# EAGLE design STM32F030 v1 (EAGLE 6.5.0)
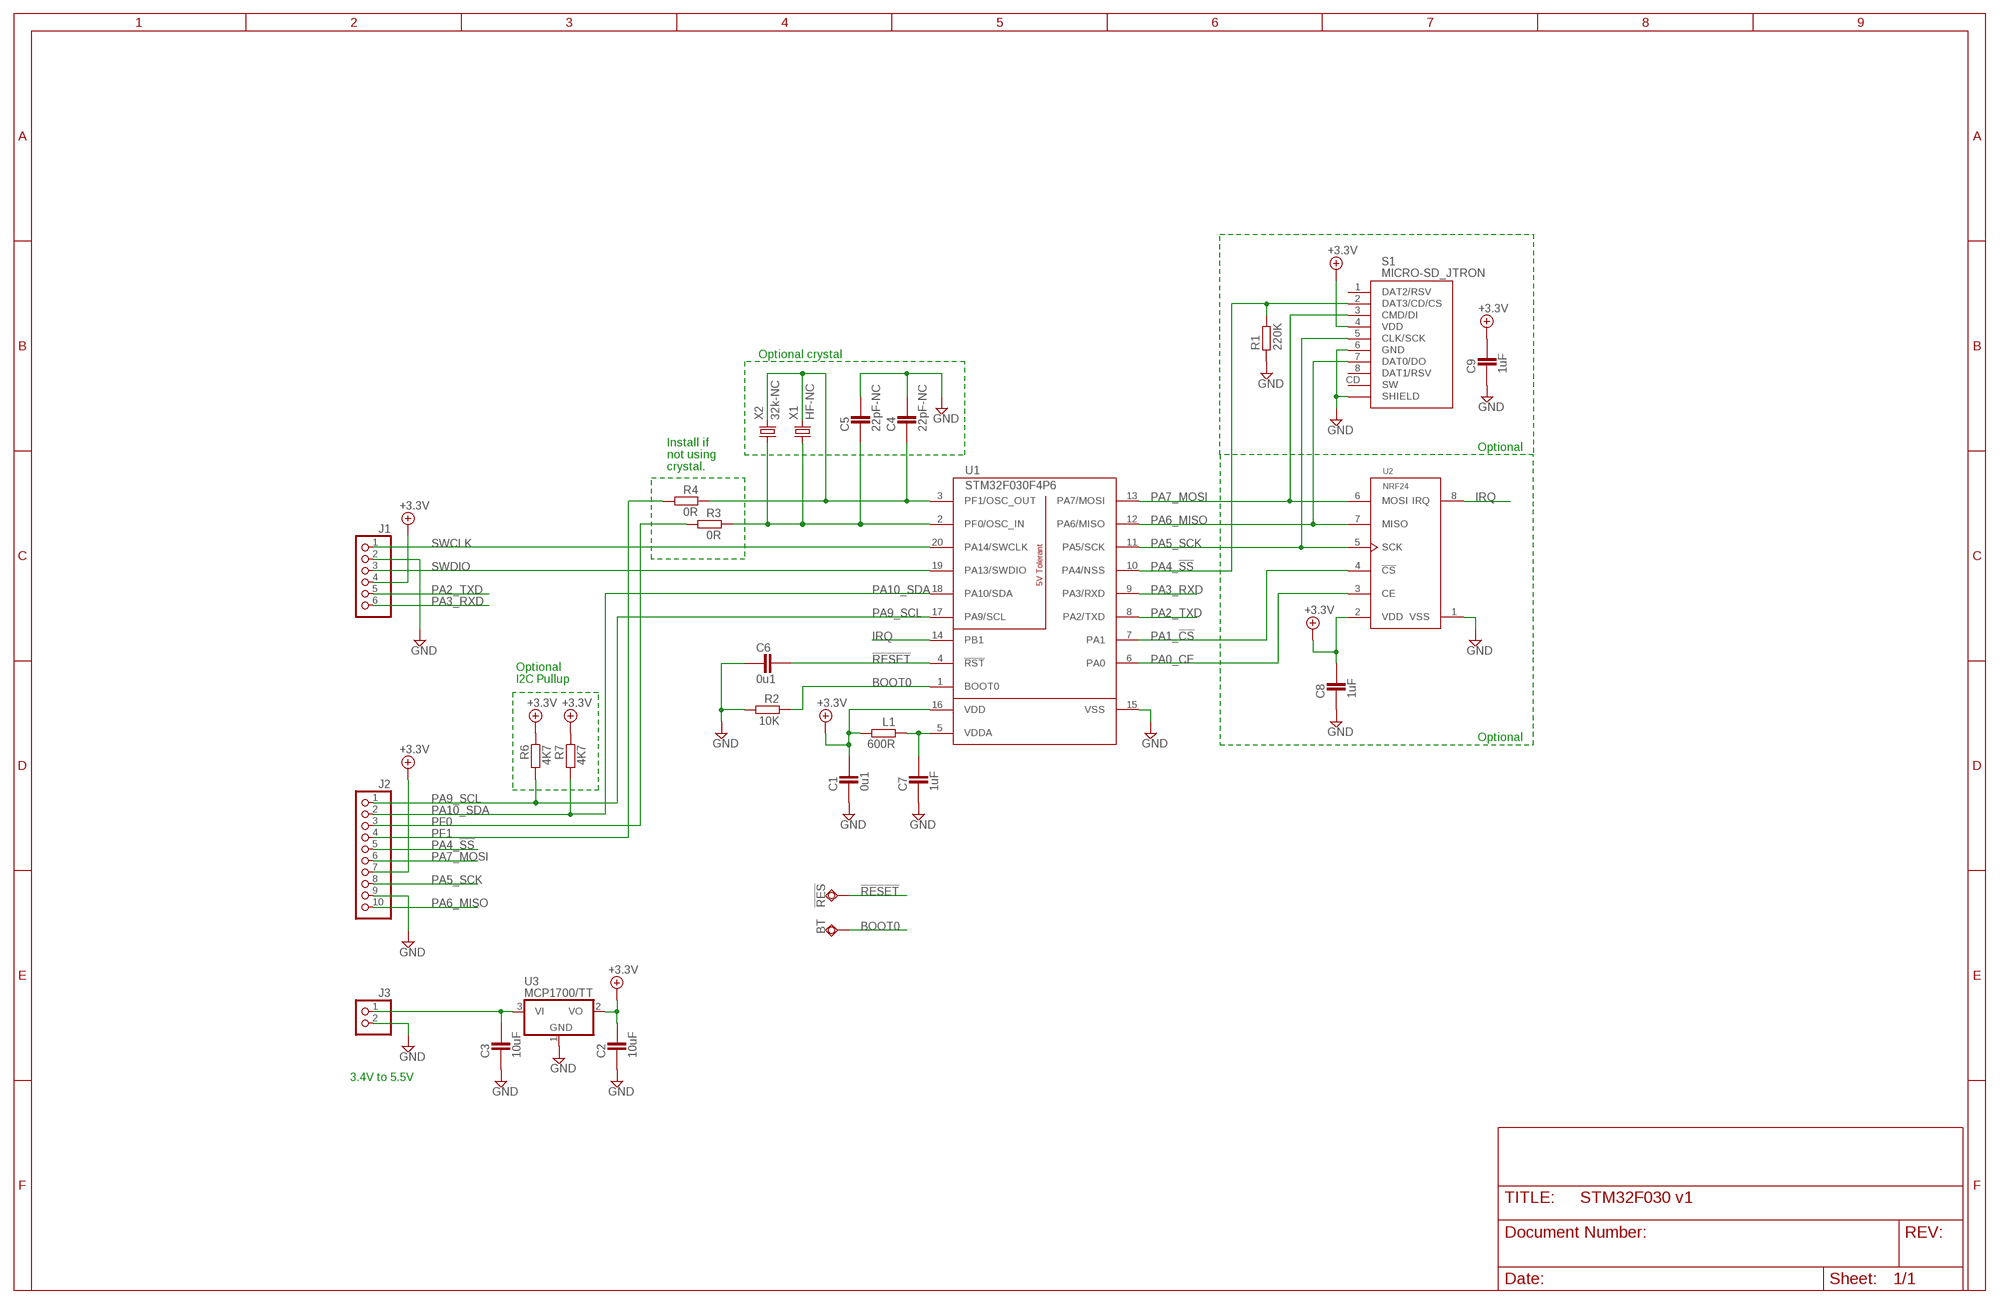
[diagram p0: schematic, sheet 1]

## Parts
!RES  TPSQTP08SQ  [TP08SQ]
BT  TPSQTP08SQ  [TP08SQ]
C1  0u1  CAPACITOR_0603  [CAPC1608X92N]
C2  10uF  CAPACITOR_0805  [CAPC2012X145AN]
C3  10uF  CAPACITOR_0805  [CAPC2012X145AN]
C4  22pF-NC  CAPACITOR_0603  [CAPC1608X92N]
C5  22pF-NC  CAPACITOR_0603  [CAPC1608X92N]
C6  0u1  CAPACITOR_0603  [CAPC1608X92N]
C7  1uF  CAPACITOR_0603  [CAPC1608X92N]
C8  1uF  CAPACITOR_0603  [CAPC1608X92N]
C9  1uF  CAPACITOR_0603  [CAPC1608X92N]
J1  PINHD-1X6  [1X06]
J2  PINHD-1X10  [1X10]
J3  PINHD-1X2_2.54  [1X02]
L1  600R  RESISTOR_0603  [RESC1608X55N]
R1  220K  RESISTOR_0603  [RESC1608X55N]
R2  10K  RESISTOR_0603  [RESC1608X55N]
R3  0R  RESISTOR_0603  [RESC1608X55N]
R4  0R  RESISTOR_0603  [RESC1608X55N]
R6  4K7  RESISTOR_0603  [RESC1608X55N]
R7  4K7  RESISTOR_0603  [RESC1608X55N]
S1  MICRO-SD_JTRON  [JTRON-MICROSD]
U1  STM32F030F4P6  [TSSOP20]
U2  NRF24  [NRF24L01]
U3  MCP1700/TT  [SOT95P280X135-3N]
X1  HF-NC  CRYSTALSM49  [SM49]
X2  32k-NC  CRYSTALWATCH  [CRYSTAL32SMT]

## Nets
!RESET: !RES.TP C6.2 U1.4(!RST)
+3.3V: C1.2 C2.2 C8.2 C9.2 J1.4 J2.7 L1.2 R6.1 R7.1 S1.4(VDD) U1.16(VDD) U2.2(VDD) U3.2(VO)
BOOT0: BT.TP R2.1 U1.1(BOOT0)
GND: C1.1 C2.1 C3.1 C4.2 C5.2 C6.1 C7.1 C8.1 C9.1 J1.2 J2.9 J3.2 R1.1 R2.2 S1.6(GND) S1.SHIELD@1(SHIELD) S1.SHIELD@2(SHIELD) S1.SHIELD@3(SHIELD) S1.SHIELD@4(SHIELD) U1.15(VSS) U2.1(VSS) U3.1(GND)
IRQ: U1.14(PB1) U2.8(IRQ)
N$4: C7.2 L1.1 U1.5(VDDA)
N$7: C3.2 J3.1 U3.3(VI)
N$9: C4.1 R4.1 U1.3(PF1/OSC_OUT) X1.2 X2.2
N$10: C5.1 R3.1 U1.2(PF0/OSC_IN) X1.1 X2.1
PA0_CE: U1.6(PA0) U2.3(CE)
PA1_!CS: U1.7(PA1) U2.4(!CS)
PA2_TXD: J1.5 U1.8(PA2/TXD)
PA3_RXD: J1.6 U1.9(PA3/RXD)
PA4_!SS: J2.5 R1.2 S1.2(DAT3/CD/CS) U1.10(PA4/NSS)
PA5_SCK: J2.8 S1.5(CLK/SCK) U1.11(PA5/SCK) U2.5(SCK)
PA6_MISO: J2.10 S1.7(DAT0/DO) U1.12(PA6/MISO) U2.7(MISO)
PA7_MOSI: J2.6 S1.3(CMD/DI) U1.13(PA7/MOSI) U2.6(MOSI)
PA9_SCL: J2.1 R6.2 U1.17(PA9/SCL)
PA10_SDA: J2.2 R7.2 U1.18(PA10/SDA)
PF0: J2.3 R3.2
PF1: J2.4 R4.2
SWCLK: J1.1 U1.20(PA14/SWCLK)
SWDIO: J1.3 U1.19(PA13/SWDIO)
Unconnected: S1.1(DAT2/RSV) S1.8(DAT1/RSV) S1.CD(SW)

## Notes on the sheet
- Optional crystal
- Optional
- Install if
  not using
  crystal.
- Optional
  I2C Pullup
- Optional
- 3.4V to 5.5V

## Library data of the parts
!RES BT = testpad:TPSQ: Test pad; PARTNO: -
C1 C6 = ipc-7351-capacitor:CAPACITOR_; PARTNO: 0U1, 0603
C2 C3 = ipc-7351-capacitor:CAPACITOR_; PARTNO: 10uF, 0805
C4 C5 = ipc-7351-capacitor:CAPACITOR_; PARTNO: 22PF, 0603
C7-C9 = ipc-7351-capacitor:CAPACITOR_; PARTNO: 1UF, 0603
J1 = Misc Conn:PINHD-1X6: PIN HEADER; PARTNO: HEADER 1X6
J2 = Misc Conn:PINHD-1X10: PIN HEADER; PARTNO: HEADER 1X10
J3 = Misc Conn:PINHD-1X2: PIN HEADER; PARTNO: HEADER 1X2
L1 = ipc-7351-resistor:RESISTOR_; PARTNO: FERRITE 0603 600R 0.2A
R1 = ipc-7351-resistor:RESISTOR_; PARTNO: 220K, 0603
R2 = ipc-7351-resistor:RESISTOR_; PARTNO: 10K, 0603
R3 R4 = ipc-7351-resistor:RESISTOR_; PARTNO: 0R, 0603
R6 R7 = ipc-7351-resistor:RESISTOR_; PARTNO: 4K7, 0603
S1 = Misc Conn:MICRO-SD_; PARTNO: JTRON MICROSD SOCKET
U1 = Misc Processor:STM32F030F4P6; PARTNO: STM32F030F4P6
U2 = misc pcb:NRF24; PARTNO: NRF24L01+ MODULE
U3 = Misc Power:MCP1700; PARTNO: MCP1700T-3302E/TT
X1 = Misc Passives:CRYSTAL: CRYSTAL; PARTNO: 12MHZ, HC49/US
X2 = Misc Passives:CRYSTAL: CRYSTAL; PARTNO: 32.768KHZ

## Board
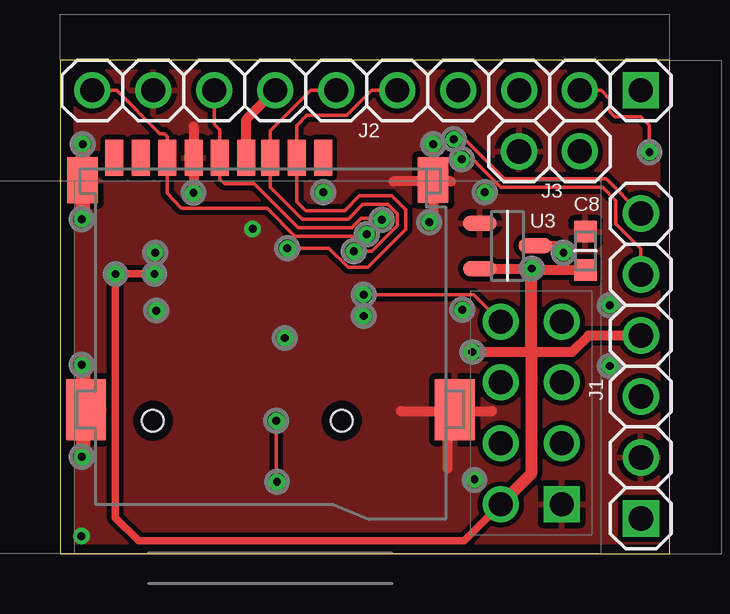
[diagram p1: board, top side]
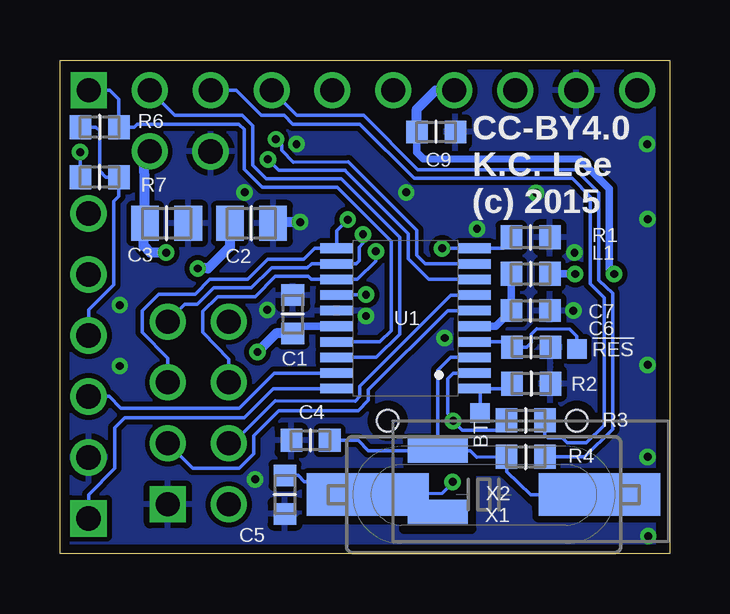
[diagram p2: board, bottom side, seen from below]

Size 25.4 x 20.57 mm. Coordinates in mm from the lower left corner, seen from the top.
Outline: 0,0 25.4,0 25.4,20.57 0,20.57 0,0
Copper layers (1*16): Top 0.0356mm / dielectric 1.5011mm / Bottom 0.0356mm
Design rules "oshpark-2layer": minimum track width 6mil, minimum drill 13mil, track to track 6mil, track to pad 6mil, pad to pad 6mil, via to via 6mil, smd to smd 6mil, copper to edge 15mil, drill to drill 6mil, minimum pad ring 7mil, minimum via ring 7mil, stop-mask expansion 4mil, vias tented up to drill 0mil, thermal gap 10mil
bRestrict: 10 lines

### Footprints (pad centres in the part's own frame; a part is rotated, then mirrored left to right if it is on the bottom)
TP08SQ = smd 0.8 x 0.8: TP 0,0
CAPC1608X92N = smd 0.9 x 0.95: 1 -0.8,0; 2 0.8,0
CAPC2012X145AN = smd 1.15 x 1.45: 1 -0.9,0; 2 0.9,0
1X06 = drill 1.016 square: 1 -6.35,0 | drill 1.016: 2 -3.81,0; 3 -1.27,0; 4 1.27,0; 5 3.81,0; 6 6.35,0
1X10 = drill 1 square: 1 -11.43,0 | drill 1: 2 -8.89,0; 3 -6.35,0; 4 -3.81,0; 5 -1.27,0; 6 1.27,0; 7 3.81,0; 8 6.35,0; 9 8.89,0; 10 11.43,0
1X02 = drill 1: 1 -1.27,0 | drill 1.016: 2 1.27,0
RESC1608X55N = smd 0.9 x 1: 1 -0.8,0; 2 0.8,0
JTRON-MICROSD = smd 0.75 x 1.5: 1 2.204,10.956; 2 1.103,10.956; 3 0.004,10.956; 4 -0.997,10.956; 5 -2.096,10.956; 6 -3.196,10.956; 7 -4.296,10.956; 8 -5.396,10.956; CD -6.497,10.956 | smd 1.27 x 1.91: SHIELD@1 -7.823,10.033 | smd 1.27 x 1.905: SHIELD@2 6.782,10.033 | smd 1.651 x 2.54: SHIELD@3 7.684,0.47; SHIELD@4 -7.684,0.47 | hole 0.9: -4.889,0.013; 2.985,0.013
TSSOP20 = smd 0.4 x 1.35: 1 -2.925,-2.875; 2 -2.275,-2.875; 3 -1.625,-2.875; 4 -0.975,-2.875; 5 -0.325,-2.875; 6 0.325,-2.875; 7 0.975,-2.875; 8 1.625,-2.875; 9 2.275,-2.875; 10 2.925,-2.875; 11 2.925,2.875; 12 2.275,2.875; 13 1.625,2.875; 14 0.975,2.875; 15 0.325,2.875; 16 -0.325,2.875; 17 -0.975,2.875; 18 -1.625,2.875; 19 -2.275,2.875; 20 -2.925,2.875
NRF24L01 = drill 1 square: 1 0,0 | drill 1: 2 -2.54,0; 3 0,2.54; 4 -2.54,2.54; 5 0,5.08; 6 -2.54,5.08; 7 0,7.62; 8 -2.54,7.62
SOT95P280X135-3N = smd 1.4 x 0.65: 1 -1.15,0.95; 2 -1.15,-0.95; 3 1.15,0
SM49 = smd 5.08 x 1.778: 1 -4.826,0; 2 4.826,0
CRYSTAL32SMT = smd 2.5 x 1: 1 2.125,1.27; 2 2.125,-1.27

### Placement (x,y rotation side)
!RES  3.86,8.53 0 bottom
BT  7.9,5.87 0 bottom
C1  15.7,9.98 270 bottom
C2  17.42,13.77 180 bottom
C3  20.95,13.77 180 bottom
C4  14.96,4.72 180 bottom
C5  16.03,2.46 270 bottom
C6  5.77,8.61 180 bottom
C7  5.79,10.13 180 bottom
C8  21.89,12.62 270 top
C9  9.73,17.58 180 bottom
J1  24.21,7.82 90 top
J2  12.78,19.3 180 top
J3  20.4,16.76 180 top
L1  5.79,11.66 0 bottom
R1  5.79,13.18 180 bottom
R2  5.77,7.09 0 bottom
R3  5.99,5.56 0 bottom
R4  5.99,4.04 0 bottom
R6  23.75,17.78 0 bottom
R7  23.75,15.7 180 bottom
S1  8.76,5.54 0 top
U1  11,9.8 90 bottom
U2  20.9,2.06 0 top
U3  18.64,12.83 0 top
X1  7.75,2.46 0 bottom
X2  7.54,3.02 180 bottom

### Tracks (layer width: path | path; a pad name or v marks a point on that pad's centre or on a via)
!RESET
  Bottom 0.152: U1.4 6.79,8.83 C6.2 5.94,8.61 5.77,8.79 5.77,9.14 5.54,9.37 4.17,9.35 3.86,9.07 !RES.TP
+3.3V  (via drill 0.33)
  Top 0.305: U2.2 16.84,0.53 3.28,0.53 2.31,1.5 v2.31,11.66 v3.94,11.66
  Top 0.406: v17.17,8.41 19.63,8.41 21.34,8.41 22.02,9.09 J1.4 | J2.7 7.77,18.1 S1.4 | 19.63,11.86 v19.66,11.89 | U3.2 v19.65,11.88 v19.66,11.89 | C8.2 19.72,11.82 v19.66,11.89
  Top 0.508: U2.2 19.63,3.33 19.63,8.41 19.63,11.86
  Bottom 0.152: R6.1 23.9,17.78 23.75,17.63 23.75,15.95 23.49,15.7 R7.1 22.95,14.9 23.16,14.68 23.16,11.2 24.21,10.16 J1.4
  Bottom 0.305: C9.2 10.53,16.73 10.26,16.46 3.76,16.43 3.73,16.43 2.51,15.21 2.51,11.86 v2.31,11.66 | L1.2 v3.94,11.66 | U1.16 15.27,9.48 C1.2
  Bottom 0.406: C9.2 10.53,18.53 9.75,19.3 J2.7 | C2.2 18.32,12.79 19.23,11.89 v19.66,11.89 | C1.2 16.4,9.18 v17.17,8.41
BOOT0
  Bottom 0.152: BT.TP 7.9,6.83 U1.1 6.65,6.88 R2.1
GND  (via drill 0.33)
  Top 0.406: 5.56,17.8 v5.56,15.04 | 14.2,5.94 16.15,5.94 | 16.15,5.94 18.01,5.94 | 16.15,3.56 16.15,5.94 | 16.28,15.52 13.89,15.52 | v15.54,17.07 15.54,13.84
  Top 0.61: 0.94,16.84 0.94,14 | 0.96,7.98 0.96,4.04
  Bottom 0.152: C6.1 4.89,8.42
  Bottom 0.305: 16.54,13.82 16.54,14.1
  Bottom 0.406: v15.39,13.82 16.54,13.82
  other vias: 17.27,3.1 0.91,13.94 22.91,7.82 12.65,9.91 0.91,7.87 10.97,15.06 22.91,10.36 0.91,4.04 8.03,13.54 0.94,17.07 0.89,0.74 4.01,10.13 9.37,8.99 16.76,10.16 17.7,15.06 3.96,12.55
  pour Bottom (isolate 0.203): 0.64,0.13 0.64,20.45 25.4,20.45 25.4,0.13
  pour Top (isolate 0.203): 25.53,0.13 25.4,20.45 0.64,20.45 0.64,0.13
IRQ  (via drill 0.33)
  Top 0.152: U2.8 17.25,10.79 v12.65,10.79
  Bottom 0.152: v12.65,10.79 13.86,10.79 U1.14
N$4
  Bottom 0.305: U1.5 7.25,9.48 C7.2 L1.1
N$7  (via drill 0.33)
  Top 0.406: U3.3 20.7,12.83 v20.98,12.55
  Bottom 0.406: J3.1 21.88,16.55 C3.2 21.92,13.88 21.92,12.83 21.64,12.55 v20.98,12.55
N$9
  Bottom 0.152: U1.3 9.12,8.18 9.65,7.64 9.65,5.59 9.67,5.05 X2.2 | X2.2 8.31,4.29 8.03,4.01 R4.1 6.79,3.42 5.79,2.46 X1.2 | X2.2 12.55,4.29 12.98,4.72 C4.1
N$10  (via drill 0.33)
  Top 0.152: v9.02,5.54 9.02,3.05 v9.04,3
  Bottom 0.152: 12.52,2.31 X1.1 | X2.1 11.63,2.18 X1.1 | U1.2 9.01,7.53 9.25,7.29 9.25,5.84 v9.02,5.54 8.64,5.16 7.11,5.16 7.06,5.26 6.93,5.44 6.78,5.56 R3.1 | v9.04,3 9.04,2.95 9.47,2.51 14,2.49 | 14,2.49 14.17,2.49 14.07,2.64 | 14.07,2.64 12.09,2.64 X1.1 | 14.17,2.32 14,2.49 | C5.1 15.48,3.26 15.21,3 14.43,3 14.07,2.64
PA0_CE
  Bottom 0.152: U2.3 19.86,3.56 17.93,3.56 17.32,4.17 17.32,4.93 16.28,5.97 12.98,5.97 12.55,6.4 12.55,6.83 9.25,10.13 U1.6
PA1_!CS
  Bottom 0.152: U2.4 18.21,4.6 16.43,6.38 13.11,6.35 12.9,6.55 12.9,6.98 9.11,10.78 U1.7
PA2_TXD  (via drill 0.33)
  Top 0.152: J1.5 24.21,12.7 23.16,13.74 23.16,14.71 22.61,15.27 18.36,15.27 17.2,16.43 v16.74,16.43
  Bottom 0.152: U1.8 10.03,11.43 10.9,12.29 10.9,13.34 13.51,15.95 13.51,15.98 16.28,15.98 v16.74,16.43
PA3_RXD  (via drill 0.33)
  Top 0.152: J1.6 22.76,15.62 18.52,15.62 16.87,17.27 v16.41,17.27
  Bottom 0.152: v16.41,17.27 16.15,17.02 16.15,16.81 15.67,16.31 13.39,16.33 10.54,13.49 10.54,12.45 10.17,12.08 U1.9
PA4_!SS  (via drill 0.33)
  Top 0.152: v9.47,12.73 11.2,12.73 12.01,11.94 12.83,11.94 14.4,13.51 14.4,14.33 13.82,14.91 12.47,14.91 11.86,14.3 10.24,14.3 9.87,14.67 S1.2 9.87,17.84 10.29,18.26 11.94,18.26 12.98,19.3 J2.5
  Bottom 0.152: U1.10 | U1.10 v9.47,12.73 | U1.10 6.92,12.73 R1.2
PA5_SCK  (via drill 0.33)
  Top 0.152: v13.41,13.92 13.36,13.97 12.55,13.97 12.17,13.59 9.93,13.59 8.1,15.42 6.86,15.42 6.67,15.61 S1.5 6.67,17.67 6.43,17.91 J2.8
  Bottom 0.152: U2.5 20.9,8.15 21.97,9.22 21.97,10.13 21.29,10.82 19.76,10.82 19.15,11.43 17.58,11.43 16.74,12.27 15.24,12.27 14.78,12.73 U1.11 13.87,13.46 v13.41,13.92
PA6_MISO  (via drill 0.33)
  Top 0.152: v12.78,13.31 12.37,13.31 12.29,13.23 9.78,13.23 8.64,14.4 5.05,14.4 4.47,15.02 S1.7 4.47,17.38 4.34,17.5 4.16,17.5 2.36,19.3 J2.10
  Bottom 0.152: U2.7 20.19,10.39 19.68,10.39 19,11.07 17.42,11.07 16.59,11.91 15.09,11.91 14.92,12.08 U1.12 13.07,12.08 12.93,12.22 12.93,12.78 12.78,12.93 v12.78,13.31
PA7_MOSI  (via drill 0.33)
  Top 0.152: v12.24,12.6 12.98,12.6 14.05,13.67 14.05,14.17 13.67,14.55 12.62,14.55 12.01,13.95 10.08,13.95 8.77,15.26 S1.3 8.77,17.63 10.44,19.3 J2.6
  Bottom 0.152: U2.6 18.36,8.1 19.46,9.22 19.46,10.11 18.82,10.72 17.27,10.72 16.43,11.56 15.06,11.56 14.94,11.43 U1.13 13.01,11.43 12.24,12.19 v12.24,12.6
PA9_SCL
  Bottom 0.152: J2.1 23.32,19.3 22.95,18.94 R6.2 | 22.88,17.8 22.9,17.79 R6.2 | R6.2 22.3,17.78 22.17,17.91 17.96,17.91 17.73,17.68 17.73,16.03 16.97,15.27 13.84,15.27 11.61,13.03 11.61,9.3 12.08,8.83 U1.17
PA10_SDA  (via drill 0.33)
  Top 0.152: J2.2 22.55,19.3 22.91,18.95 22.91,18.41 23.11,18.21 24.21,18.21 24.56,17.86 v24.56,16.74
  Bottom 0.152: R7.2 v24.55,16.73 v24.56,16.74 | U1.18 | U1.18 12.22,8.18 11.25,9.14 11.25,13.18 13.69,15.62 16.81,15.62 17.37,16.18 17.37,17.83 17.8,18.26 20.62,18.26 J2.2
PF0
  Bottom 0.152: J2.3 18.06,19.3 17.02,18.26 16.05,18.26 15.7,17.91 12.9,17.91 10.64,15.65 4.06,15.65 3.3,14.88 3.3,11.25 2.72,10.67 2.72,5.36 3.48,4.62 4.27,4.62 4.47,4.83 5.08,4.83 5.19,4.94 R3.2
PF1
  Bottom 0.152: R4.2 3.53,4.04 2.36,5.18 2.36,10.85 2.95,11.41 2.95,15.04 3.91,16 10.49,16 12.75,18.26 15.54,18.26 J2.4
SWCLK
  Bottom 0.152: U1.20 16.51,6.88 17.73,5.66 22.71,5.66 23.11,5.26 23.11,3.56 24.21,2.46 J1.1
SWDIO
  Bottom 0.152: U1.19 16.47,7.53 17.93,6.07 22.86,6.07 23.34,6.55 J1.3

### Text on the board
bPlace: CC-BY4.0 / K.C. Lee / (c) 2015